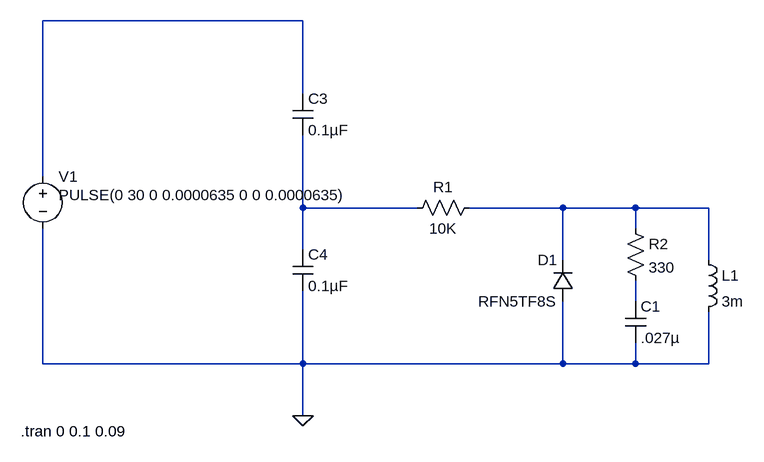
[diagram p0: schematic horizontalYoke.asc]
horizontalYoke.asc, the LTspice schematic file:
Version 4
SHEET 1 880 1048
WIRE -304 240 -704 240
WIRE -304 352 -304 240
WIRE -704 480 -704 240
WIRE -304 528 -304 416
WIRE -128 528 -304 528
WIRE 96 528 -48 528
WIRE 208 528 96 528
WIRE 320 528 208 528
WIRE 208 560 208 528
WIRE -304 592 -304 528
WIRE 96 608 96 528
WIRE 320 608 320 528
WIRE 208 672 208 640
WIRE -704 768 -704 560
WIRE -304 768 -304 656
WIRE -304 768 -704 768
WIRE 96 768 96 672
WIRE 96 768 -304 768
WIRE 208 768 208 736
WIRE 208 768 96 768
WIRE 320 768 320 688
WIRE 320 768 208 768
WIRE -304 848 -304 768
FLAG -304 848 0
SYMBOL ind 304 592 R0
SYMATTR InstName L1
SYMATTR Value 3m
SYMBOL res -32 512 R90
WINDOW 0 0 56 VBottom 2
WINDOW 3 32 56 VTop 2
SYMATTR InstName R1
SYMATTR Value 10K
SYMBOL cap 192 672 R0
SYMATTR InstName C1
SYMATTR Value .027µ
SYMBOL diode 112 672 R180
WINDOW 0 24 64 Left 2
WINDOW 3 24 0 Left 2
SYMATTR InstName D1
SYMATTR Value RFN5TF8S
SYMBOL cap -320 352 R0
SYMATTR InstName C3
SYMATTR Value 0.1µF
SYMBOL cap -320 592 R0
SYMATTR InstName C4
SYMATTR Value 0.1µF
SYMBOL voltage -704 464 R0
WINDOW 3 24 44 Left 2
WINDOW 123 0 0 Left 2
WINDOW 39 0 0 Left 2
SYMATTR InstName V1
SYMATTR Value PULSE(0 30 0 0.0000635 0 0 0.0000635)
SYMBOL res 192 544 R0
SYMATTR InstName R2
SYMATTR Value 330
TEXT -738 872 Left 2 !.tran 0 0.1 0.09

The netlist it stands for:
* horizontalYoke.asc
L1 N003 0 3m
R1 N003 N002 10K
C1 N004 0 .027µ
D1 0 N003 RFN5TF8S
C3 N001 N002 0.1µF
C4 N002 0 0.1µF
V1 N001 0 PULSE(0 30 0 0.0000635 0 0 0.0000635)
R2 N003 N004 330
.model D D
.lib standard.dio
.tran 0 0.1 0.09
.backanno
.end